# EAGLE design board_NRF24L01_v2 (EAGLE 7.7.0)
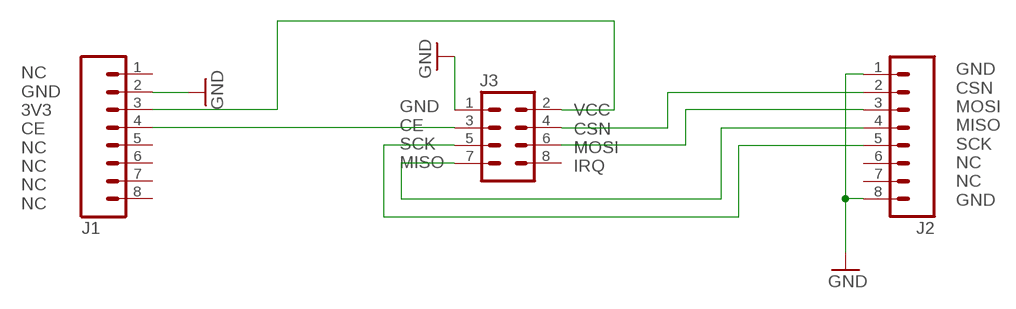
[diagram p0: schematic, sheet 1]

## Parts
J1  M08  [1X08_ROUND]
J2  M08  [1X08_ROUND]
J3  M04X2  [2X4]

## Nets
GND: J1.2 J2.1 J2.8 J3.1
N$1: J1.3 J3.2
N$2: J2.5 J3.5
N$3: J2.4 J3.7
N$4: J2.3 J3.6
N$5: J1.4 J3.3
N$6: J2.2 J3.4
Unconnected: J1.1 J1.5 J1.6 J1.7 J1.8 J2.6 J2.7 J3.8

## Notes on the sheet
- GND
  CE
  SCK
  MISO
- VCC
  CSN
  MOSI
  IRQ
- GND
  CSN
  MOSI
  MISO
  SCK
  NC
  NC
  GND
- NC
  GND
  3V3
  CE
  NC
  NC
  NC
  NC

## Library data of the parts
J1 J2 = SparkFun-Connectors:M08: Header 8 Standard 8-pin 0.1" header. Use with straight break away headers (SKU : PRT-00116), right angle break away headers (PRT-00553), swiss pins (PRT-00743), machine pins (PRT-00117), and female headers (PRT-00115).; PROD_ID: CONN-08437
J3 = SparkFun-Connectors:M04X2: .1" header, two rows of four.

## Net classes
1 rf: clearance 0.5 mm

## Board
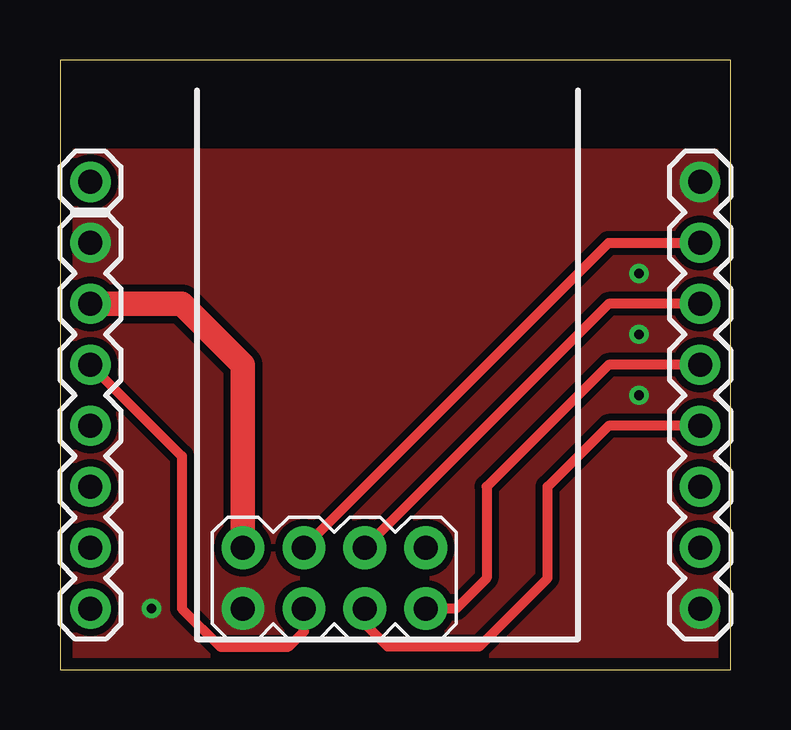
[diagram p1: board, top side]
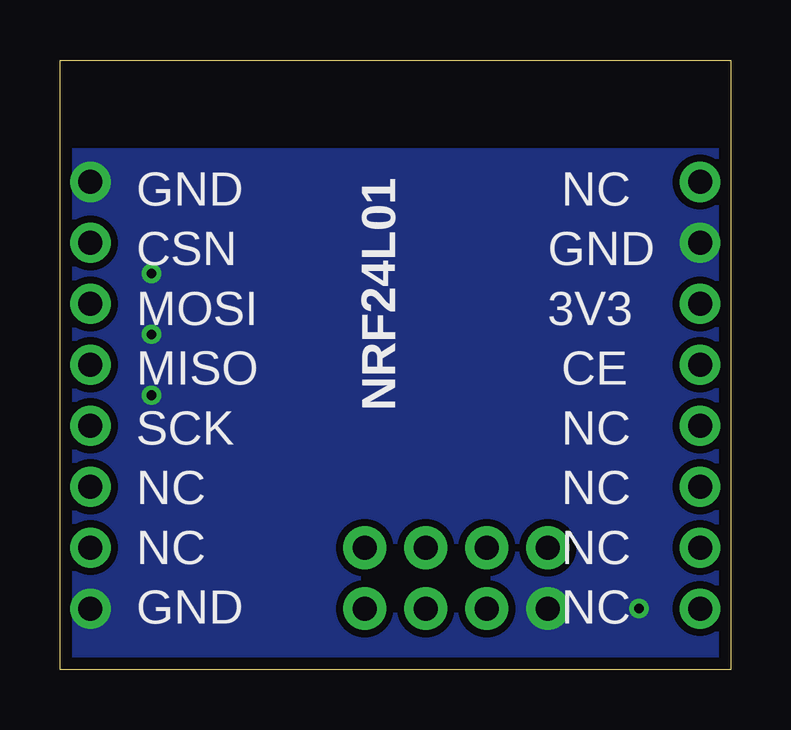
[diagram p2: board, bottom side, seen from below]

Size 27.94 x 25.4 mm. Coordinates in mm from the lower left corner, seen from the top.
Outline: 0,0 27.94,0 27.94,25.4 0,25.4 0,0
Copper layers (1*16): Top 0.035mm / dielectric 1.5mm / Bottom 0.035mm
Design rules "default *": minimum track width 10mil, minimum drill 0.4mm, track to track 0.3mm, track to pad 0.3mm, pad to pad 0.3mm, via to via 0.3mm, smd to smd 8mil, copper to edge 0.5mm, drill to drill 8mil, minimum pad ring 10mil, minimum via ring 8mil, stop-mask expansion 4mil, vias tented up to drill 0.8mm, thermal gap 10mil

### Footprints (pad centres in the part's own frame; a part is rotated, then mirrored left to right if it is on the bottom)
1X08_ROUND = drill 1 pad 1.676: 1 0,0; 2 2.54,0; 3 5.08,0; 4 7.62,0; 5 10.16,0; 6 12.7,0; 7 15.24,0; 8 17.78,0
2X4 = drill 1 pad 1.778: 1 -3.81,-1.27; 2 -3.81,1.27; 3 -1.27,-1.27; 4 -1.27,1.27; 5 1.27,-1.27; 6 1.27,1.27; 7 3.81,-1.27; 8 3.81,1.27

### Placement (x,y rotation side)
J1  1.27,20.32 270 top
J2  26.67,20.32 270 top
J3  11.43,3.81 0 top

### Tracks (layer width: path | path; a pad name or v marks a point on that pad's centre or on a via)
GND  (via drill 0.4)
  other vias: 3.81,2.54 24.13,11.43 24.13,16.51 24.13,13.97
  pour Bottom (isolate 0.254, rank 3, no thermals): 0,21.59 27.94,21.59 27.94,0 0,0
  pour Top (isolate 0.254, rank 3, no thermals): 0,21.59 27.94,21.59 27.94,0 0,0
N$1
  Top 1.016: J1.3 5.08,15.24 7.62,12.7 J3.2
N$2
  Top 0.406: J2.5 22.86,10.16 20.32,7.62 20.32,3.81 17.46,0.95 13.65,0.95 12.7,1.91 J3.5
N$3
  Top 0.406: J2.4 22.86,12.7 17.78,7.62 17.78,3.81 16.51,2.54 J3.7
N$4
  Top 0.406: J2.3 22.86,15.24 J3.6
N$5
  Top 0.406: J1.4 5.08,8.89 5.08,2.54 6.67,0.95 9.53,0.95 10.16,1.59 J3.3
N$6
  Top 0.406: J3.4 22.86,17.78 J2.2

### Text on the board
bPlace: NRF24L01 | NC / GND / 3V3 / CE / NC / NC / NC / NC | GND / CSN / MOSI / MISO / SCK / NC / NC / GND